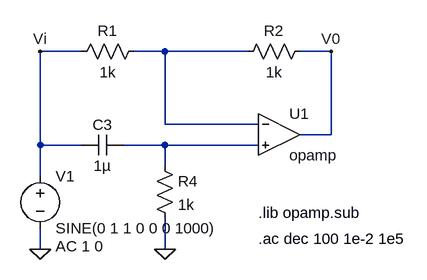
[diagram p0: schematic sim.asc]
sim.asc, the LTspice schematic file:
Version 4
SHEET 1 880 680
WIRE 32 32 -32 32
WIRE 160 32 112 32
WIRE 288 32 160 32
WIRE 416 32 368 32
WIRE 160 144 160 32
WIRE 304 144 160 144
WIRE 416 160 416 32
WIRE 416 160 368 160
WIRE -32 176 -32 32
WIRE 32 176 -32 176
WIRE 160 176 96 176
WIRE 304 176 160 176
WIRE 160 208 160 176
WIRE -32 224 -32 176
WIRE -32 336 -32 304
WIRE 160 336 160 288
FLAG 160 336 0
FLAG -32 336 0
FLAG -32 32 Vi
FLAG 416 32 V0
SYMBOL res 144 192 R0
SYMATTR InstName R4
SYMATTR Value 1k
SYMBOL cap 96 160 R90
WINDOW 0 0 32 VBottom 2
WINDOW 3 32 32 VTop 2
SYMATTR InstName C3
SYMATTR Value 1µ
SYMBOL res 128 16 R90
WINDOW 0 0 56 VBottom 2
WINDOW 3 32 56 VTop 2
SYMATTR InstName R1
SYMATTR Value 1k
SYMBOL res 384 16 R90
WINDOW 0 0 56 VBottom 2
WINDOW 3 32 56 VTop 2
SYMATTR InstName R2
SYMATTR Value 1k
SYMBOL Opamps\\opamp 336 96 R0
SYMATTR InstName U1
SYMBOL voltage -32 208 R0
WINDOW 123 24 124 Left 2
WINDOW 39 0 0 Left 0
SYMATTR InstName V1
SYMATTR Value SINE(0 1 1 0 0 0 1000)
SYMATTR Value2 AC 1 0
TEXT 304 280 Left 2 !.lib opamp.sub
TEXT 304 320 Left 2 !.ac dec 100 1e-2 1e5

The netlist it stands for:
* sim.asc
R4 N002 0 1k
C3 N002 Vi 1µ
R1 N001 Vi 1k
R2 V0 N001 1k
XU1 N001 N002 V0 opamp Aol=100K GBW=10Meg  ; pins invin noninvin out
V1 Vi 0 SINE(0 1 1 0 0 0 1000) AC 1 0
.lib opamp.sub
.ac dec 100 1e-2 1e5
.backanno
.end